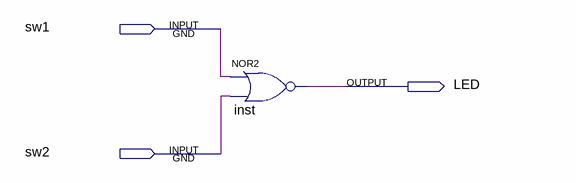
[diagram p0: schematic sheet]
// Quartus schematic ParteA.bdf as structural Verilog: 1 symbols, 3 pins
module ParteA (
  input  sw1,
  input  sw2,
  output LED
);

  nor inst (LED, sw1, sw2);
endmodule
